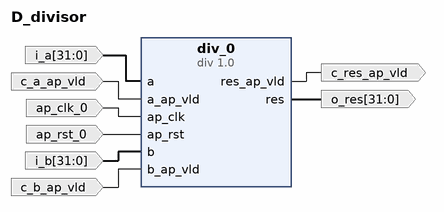
[diagram p0: block diagram of the top level]
# Vivado block design D_divisor, xczu7ev-ffvf1517-3-e, Vivado 2023.2
create_bd_design D_divisor

create_bd_port -dir I -from 31 -to 0 -type data i_a
create_bd_port -dir I c_a_ap_vld
create_bd_port -dir I -type clk ap_clk_0
create_bd_port -dir I -type rst ap_rst_0
set_property -dict {CONFIG.POLARITY ACTIVE_HIGH} [get_bd_ports ap_rst_0]
create_bd_port -dir I -from 31 -to 0 -type data i_b
create_bd_port -dir I c_b_ap_vld
create_bd_port -dir O -from 31 -to 0 -type data o_res
create_bd_port -dir O c_res_ap_vld

create_bd_cell -type ip -vlnv GbManske:Arith:div:1.0 div_0

# ---- connections ----

connect_bd_net -net a_0_1 [get_bd_ports i_a] [get_bd_pins div_0/a]
connect_bd_net -net a_ap_vld_0_1 [get_bd_ports c_a_ap_vld] [get_bd_pins div_0/a_ap_vld]
connect_bd_net -net ap_clk_0_1 [get_bd_ports ap_clk_0] [get_bd_pins div_0/ap_clk]
connect_bd_net -net ap_rst_0_1 [get_bd_ports ap_rst_0] [get_bd_pins div_0/ap_rst]
connect_bd_net -net b_0_1 [get_bd_ports i_b] [get_bd_pins div_0/b]
connect_bd_net -net b_ap_vld_0_1 [get_bd_ports c_b_ap_vld] [get_bd_pins div_0/b_ap_vld]
connect_bd_net [get_bd_pins div_0/res] [get_bd_ports o_res]
connect_bd_net [get_bd_pins div_0/res_ap_vld] [get_bd_ports c_res_ap_vld]

validate_bd_design
save_bd_design
